# Altium schematic sheet Mircroprozessor1.SchDoc
size A4
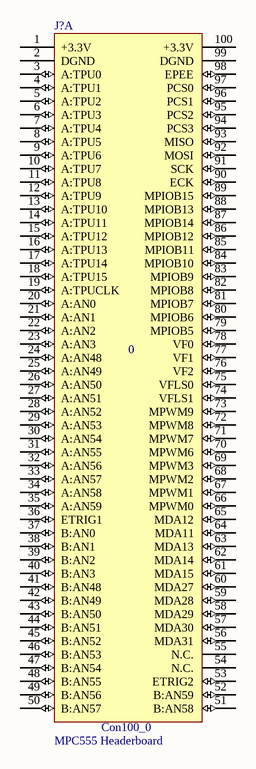
[diagram p0: Mircroprozessor1.SchDoc]

## Parts
J?  MPC555 Headerboard  [MPC555 Headerboard THT]  (part A of 3)

## Nets

Not connected (* = marked no-connect by the designer): J? 1(+3.3V) 2(DGND) 3(A:TPU0) 4(A:TPU1) 5(A:TPU2) 6(A:TPU3) 7(A:TPU4) 8(A:TPU5) 9(A:TPU6) 10(A:TPU7) 11(A:TPU8) 12(A:TPU9) 13(A:TPU10) 14(A:TPU11) 15(A:TPU12) 16(A:TPU13) 17(A:TPU14) 18(A:TPU15) 19(A:TPUCLK) 20(A:AN0) 21(A:AN1) 22(A:AN2) 23(A:AN3) 24(A:AN48) 25(A:AN49) 26(A:AN50) 27(A:AN51) 28(A:AN52) 29(A:AN53) 30(A:AN54) 31(A:AN55) 32(A:AN56) 33(A:AN57) 34(A:AN58) 35(A:AN59) 36(ETRIG1) 37(B:AN0) 38(B:AN1) 39(B:AN2) 40(B:AN3) 41(B:AN48) 42(B:AN49) 43(B:AN50) 44(B:AN51) 45(B:AN52) 46(B:AN53) 47(B:AN54) 48(B:AN55) 49(B:AN56) 50(B:AN57) 51(B:AN58) 52(B:AN59) 53(ETRIG2) 54(N.C.) 55(N.C.) 56(MDA31) 57(MDA30) 58(MDA29) 59(MDA28) 60(MDA27) 61(MDA15) 62(MDA14) 63(MDA13) 64(MDA11) 65(MDA12) 66(MPWM0) 67(MPWM1) 68(MPWM2) 69(MPWM3) 70(MPWM6) 71(MPWM7) 72(MPWM8) 73(MPWM9) 74(VFLS1) 75(VFLS0) 76(VF2) 77(VF1) 78(VF0) 79(MPIOB5) 80(MPIOB6) 81(MPIOB7) 82(MPIOB8) 83(MPIOB9) 84(MPIOB10) 85(MPIOB11) 86(MPIOB12) 87(MPIOB14) 88(MPIOB13) 89(MPIOB15) 90(ECK) 91(SCK) 92(MOSI) 93(MISO) 94(PCS3) 95(PCS2) 96(PCS1) 97(PCS0) 98(EPEE) 99(DGND) 100(+3.3V)

## Notes on the sheet
- (in symbol MPC555 Headerboard, part A) 0; Con100_0

## Library data of the parts
J? = MPC555 Headerboard: NTB MPC555 Headerboard